# EAGLE design ArduFrauenfelderCNC_0.1-b9 (EAGLE 6.1)
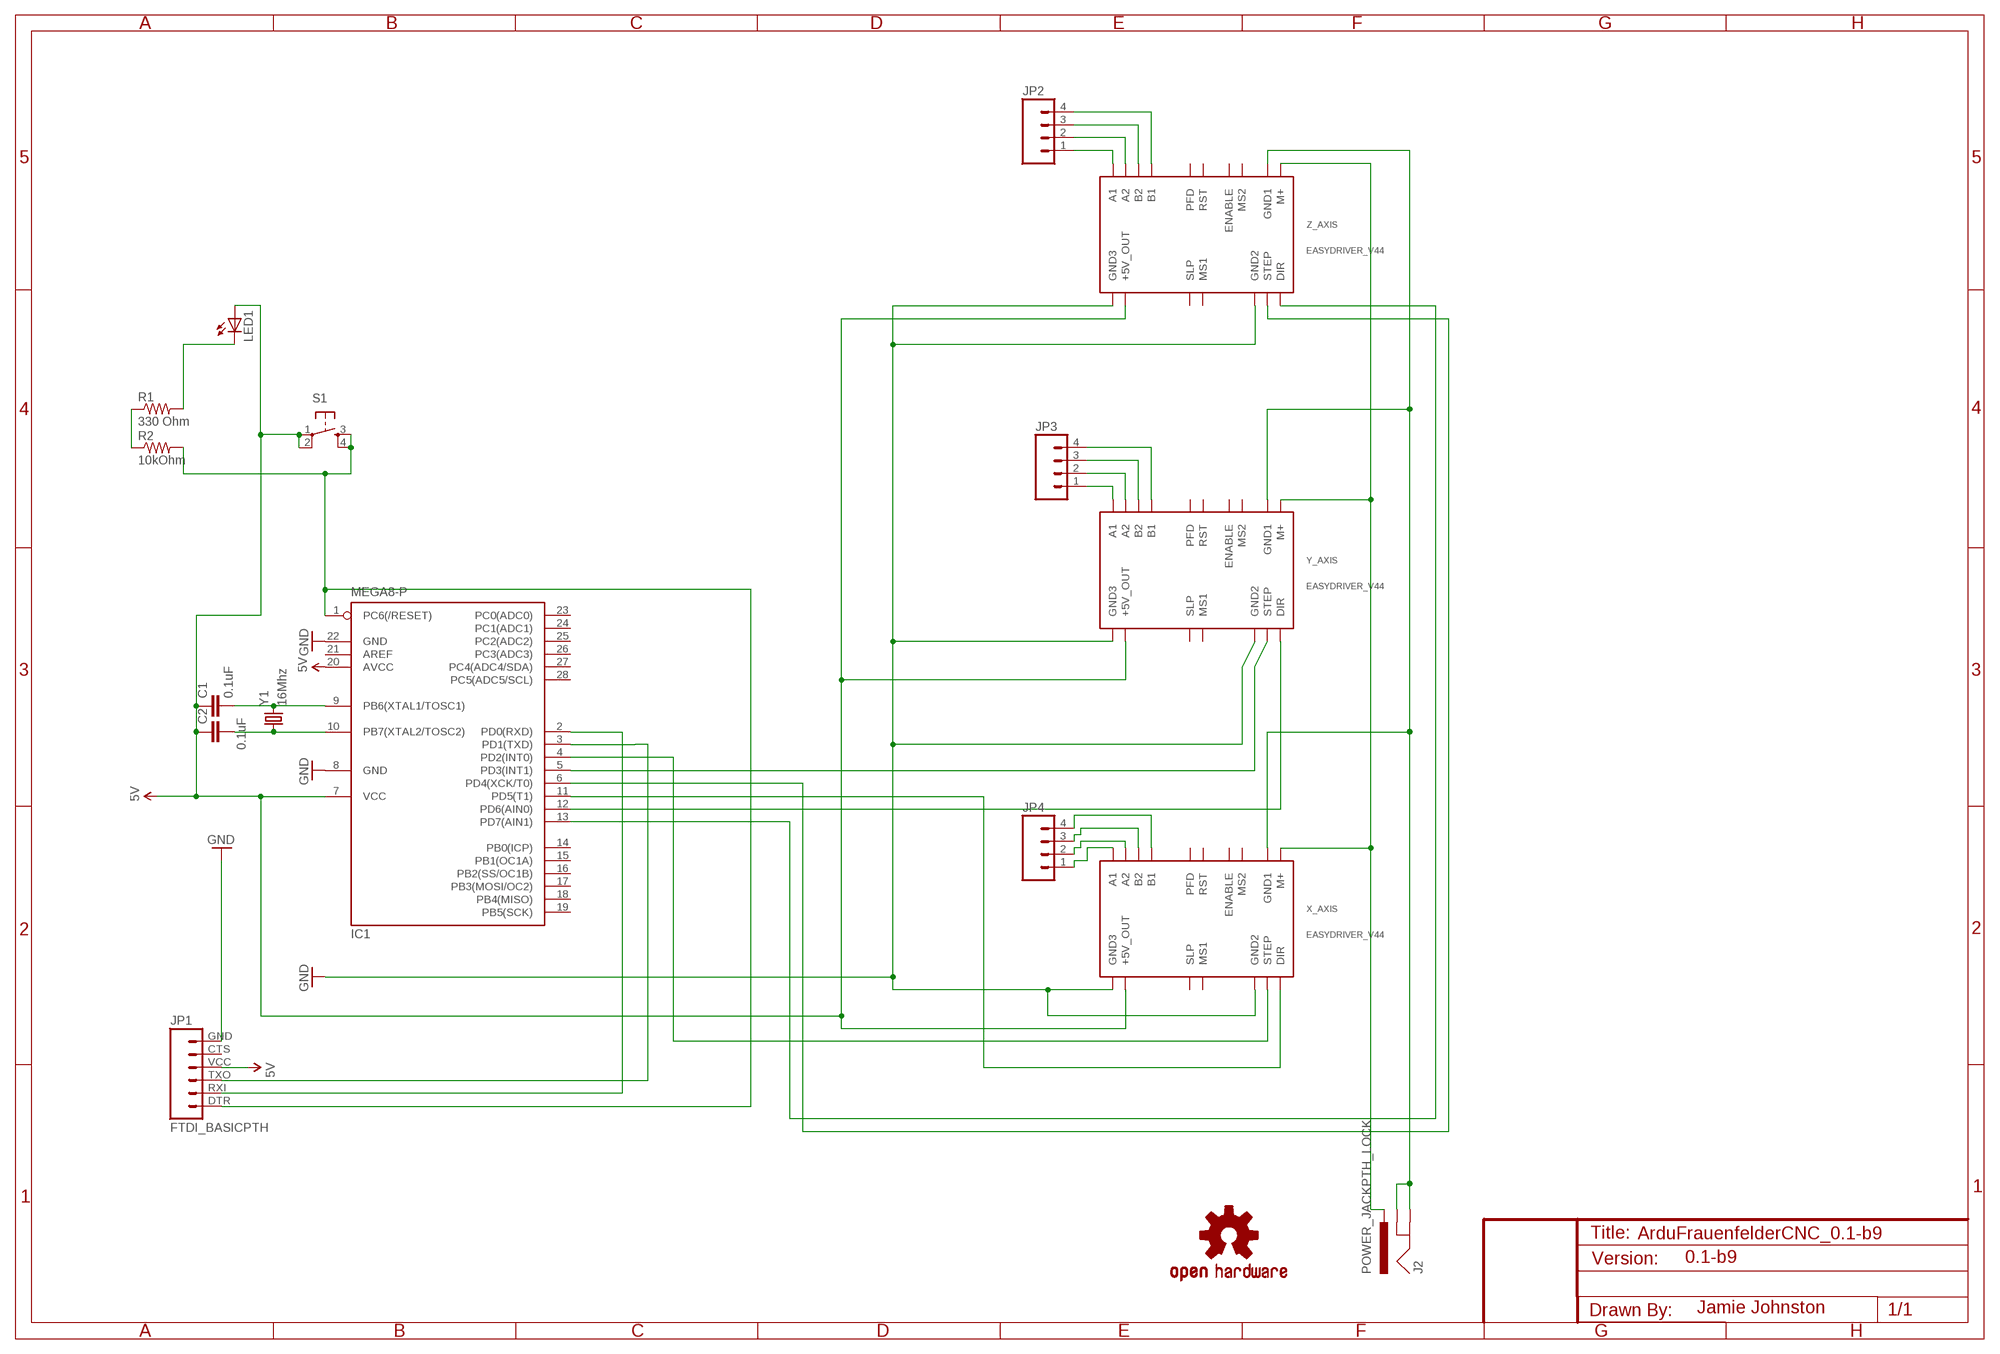
[diagram p0: schematic, sheet 1]

## Parts
C1  0.1uF  CAPPTH  [CAP-PTH-SMALL]
C2  0.1uF  CAPPTH  [CAP-PTH-SMALL]
IC1  MEGA8-P  [DIL28-3]
J2  POWER_JACKPTH_LOCK  [POWER_JACK_PTH_LOCK]
JP1  FTDI_BASICPTH  [FTDI_BASIC]
JP2  M04LOCK  [1X04_LOCK]
JP3  M04LOCK  [1X04_LOCK]
JP4  M04LOCK  [1X04_LOCK]
LED1  LED5MM  [LED5MM]
R1  330 Ohm  RESISTORPTH-1/4W  [AXIAL-0.4]
R2  10kOhm  RESISTORPTH-1/4W  [AXIAL-0.4]
S1  TAC_SWITCHPTH  [TACTILE-PTH]
U$2  OSHW-LOGOL  [OSHW-LOGO-L]
X_AXIS  EASYDRIVER_V44  [EASYDRIVER_V44]
Y1  16Mhz  CRYSTALHC49US  [HC49US]
Y_AXIS  EASYDRIVER_V44  [EASYDRIVER_V44]
Z_AXIS  EASYDRIVER_V44  [EASYDRIVER_V44]

## Nets
5V: C1.1 C2.1 IC1.7(VCC) IC1.20(AVCC) JP1.VCC LED1.A S1.1 S1.2 X_AXIS.P$11(+5V_OUT) Y_AXIS.P$11(+5V_OUT) Z_AXIS.P$11(+5V_OUT)
GND: IC1.8(GND) IC1.22(GND) JP1.GND X_AXIS.GND2 X_AXIS.GND3 Y_AXIS.GND2 Y_AXIS.GND3 Z_AXIS.GND2 Z_AXIS.GND3
N$1: C1.2 IC1.9(PB6(XTAL1/TOSC1)) Y1.2
N$2: C2.2 IC1.10(PB7(XTAL2/TOSC2)) Y1.1
N$3: IC1.5(PD3(INT1)) Y_AXIS.STEP
N$4: LED1.K(C) R1.P$2
N$5: IC1.1(PC6(/RESET)) JP1.DTR R2.P$2 S1.3 S1.4
N$6: R1.P$1 R2.P$1
N$7: JP2.1 Z_AXIS.A1
N$8: J2.PWR X_AXIS.M+ Y_AXIS.M+ Z_AXIS.M+
N$9: JP2.2 Z_AXIS.A2
N$10: J2.GND J2.GNDBREAK X_AXIS.GND1 Y_AXIS.GND1 Z_AXIS.GND1
N$11: IC1.3(PD1(TXD)) JP1.TXO
N$12: IC1.2(PD0(RXD)) JP1.RXI
N$13: IC1.12(PD6(AIN0)) Y_AXIS.DIR
N$14: IC1.4(PD2(INT0)) X_AXIS.STEP
N$15: JP2.3 Z_AXIS.B2
N$16: IC1.11(PD5(T1)) X_AXIS.DIR
N$17: JP2.4 Z_AXIS.B1
N$18: JP3.1 Y_AXIS.A1
N$19: IC1.13(PD7(AIN1)) Z_AXIS.DIR
N$20: IC1.6(PD4(XCK/T0)) Z_AXIS.STEP
N$21: JP3.2 Y_AXIS.A2
N$22: JP3.3 Y_AXIS.B2
N$23: JP3.4 Y_AXIS.B1
N$24: JP4.1 X_AXIS.A1
N$25: JP4.2 X_AXIS.A2
N$26: JP4.3 X_AXIS.B2
N$27: JP4.4 X_AXIS.B1
Unconnected: IC1.14(PB0(ICP)) IC1.15(PB1(OC1A)) IC1.16(PB2(SS/OC1B)) IC1.17(PB3(MOSI/OC2)) IC1.18(PB4(MISO)) IC1.19(PB5(SCK)) IC1.21(AREF) IC1.23(PC0(ADC0)) IC1.24(PC1(ADC1)) IC1.25(PC2(ADC2)) IC1.26(PC3(ADC3)) IC1.27(PC4(ADC4/SDA)) IC1.28(PC5(ADC5/SCL)) JP1.CTS X_AXIS.ENABLE X_AXIS.MS1 X_AXIS.MS2 X_AXIS.PFD X_AXIS.RST X_AXIS.SLEEP(SLP) Y_AXIS.ENABLE Y_AXIS.MS1 Y_AXIS.MS2 Y_AXIS.PFD Y_AXIS.RST Y_AXIS.SLEEP(SLP) Z_AXIS.ENABLE Z_AXIS.MS1 Z_AXIS.MS2 Z_AXIS.PFD Z_AXIS.RST Z_AXIS.SLEEP(SLP)

## Notes on the sheet
- 0.1-b9
- Jamie Johnston

## Library data of the parts
C1 C2 = SparkFun:CAP: Capacitor Standard 0603 ceramic capacitor, and 0.1" leaded capacitor.
IC1 = atmel:MEGA8-P: MICROCONTROLLER 8 Kbytes FLASH, 1 kbytes SRAM, 512 bytes EEPROM, USART, 4-channel 10 bit ADC, 2-channel 8 bit ADC Pin compatible with Atmega48, ATMega88, ATMega168 Source: avr.lbr; OC_FARNELL: unknown; OC_NEWARK: unknown
J2 = SparkFun:POWER_JACK: Power Jack This is the standard 5.5mm barrel jack for power. The PTH is the most common, proven, reliable, footprint. All others are experimental. The Slot footprint only works if the mill layer is transmitted to the PCB fab house so be warned. Spark Fun Electronics SKU : PRT-00119. Mating wall wart : TOL-00298 (and others)
JP1 = SparkFun:FTDI_BASIC: FTDI Basic: 3.3V and 5V
JP2-JP4 = SparkFun:M04: Header 4 Standard 4-pin 0.1" header. Use with straight break away headers (SKU : PRT-00116), right angle break away headers (PRT-00553), swiss pins (PRT-00743), machine pins (PRT-00117), and female headers (PRT-00115). Molex polarized connector foot print use with SKU : PRT-08231 with associated crimp pins and housings. 1MM SMD Version SKU: PRT-10208
LED1 = SparkFun:LED: LEDs Standard schematic elements and footprints for 5mm, 3mm, 1206, and 0603 sized LEDs. 5mm - Spark Fun Electronics SKU : COM-00529 (and others)
R1 R2 = SparkFun:RESISTOR: Resistor Basic schematic elements and footprints for 0603, 1206, and PTH resistors.
S1 = SparkFun:TAC_SWITCH: Momentary Switch Button commonly used for reset or general input. Spark Fun Electronics SKU : COM-00097
U$2 = SparkFun:OSHW-LOGO: Open Source Hardware Logo This logo indicates the piece of hardware it is found on incorporates a OSHW license and/or adheres to the definition of open source hardware found here: http://freedomdefined.org/OSHW
X_AXIS Y_AXIS Z_AXIS = EasyDriver:EASYDRIVER_V44: EasyDriver version 4.4 - http://www.schmalzhaus.com/EasyDriver
Y1 = SparkFun:CRYSTAL: Crystals Various standard crystals. Proven footprints. Spark Fun Electronics SKU : COM-00534

## Board
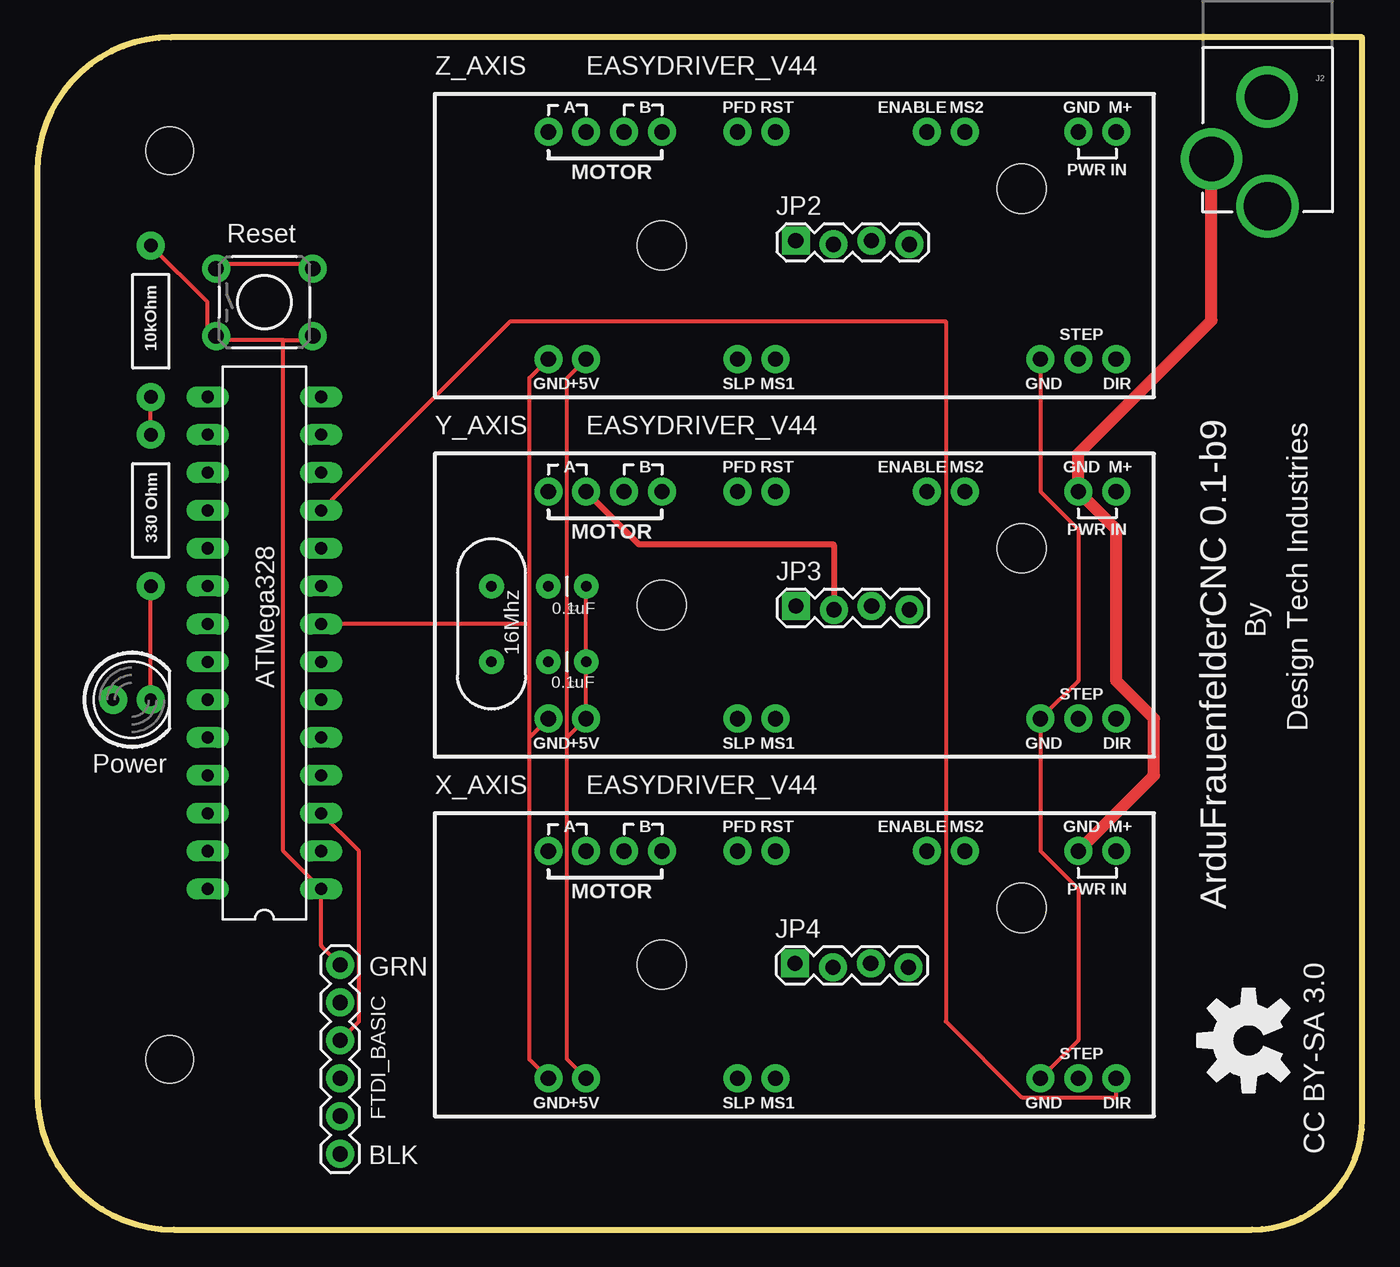
[diagram p1: board, top side]
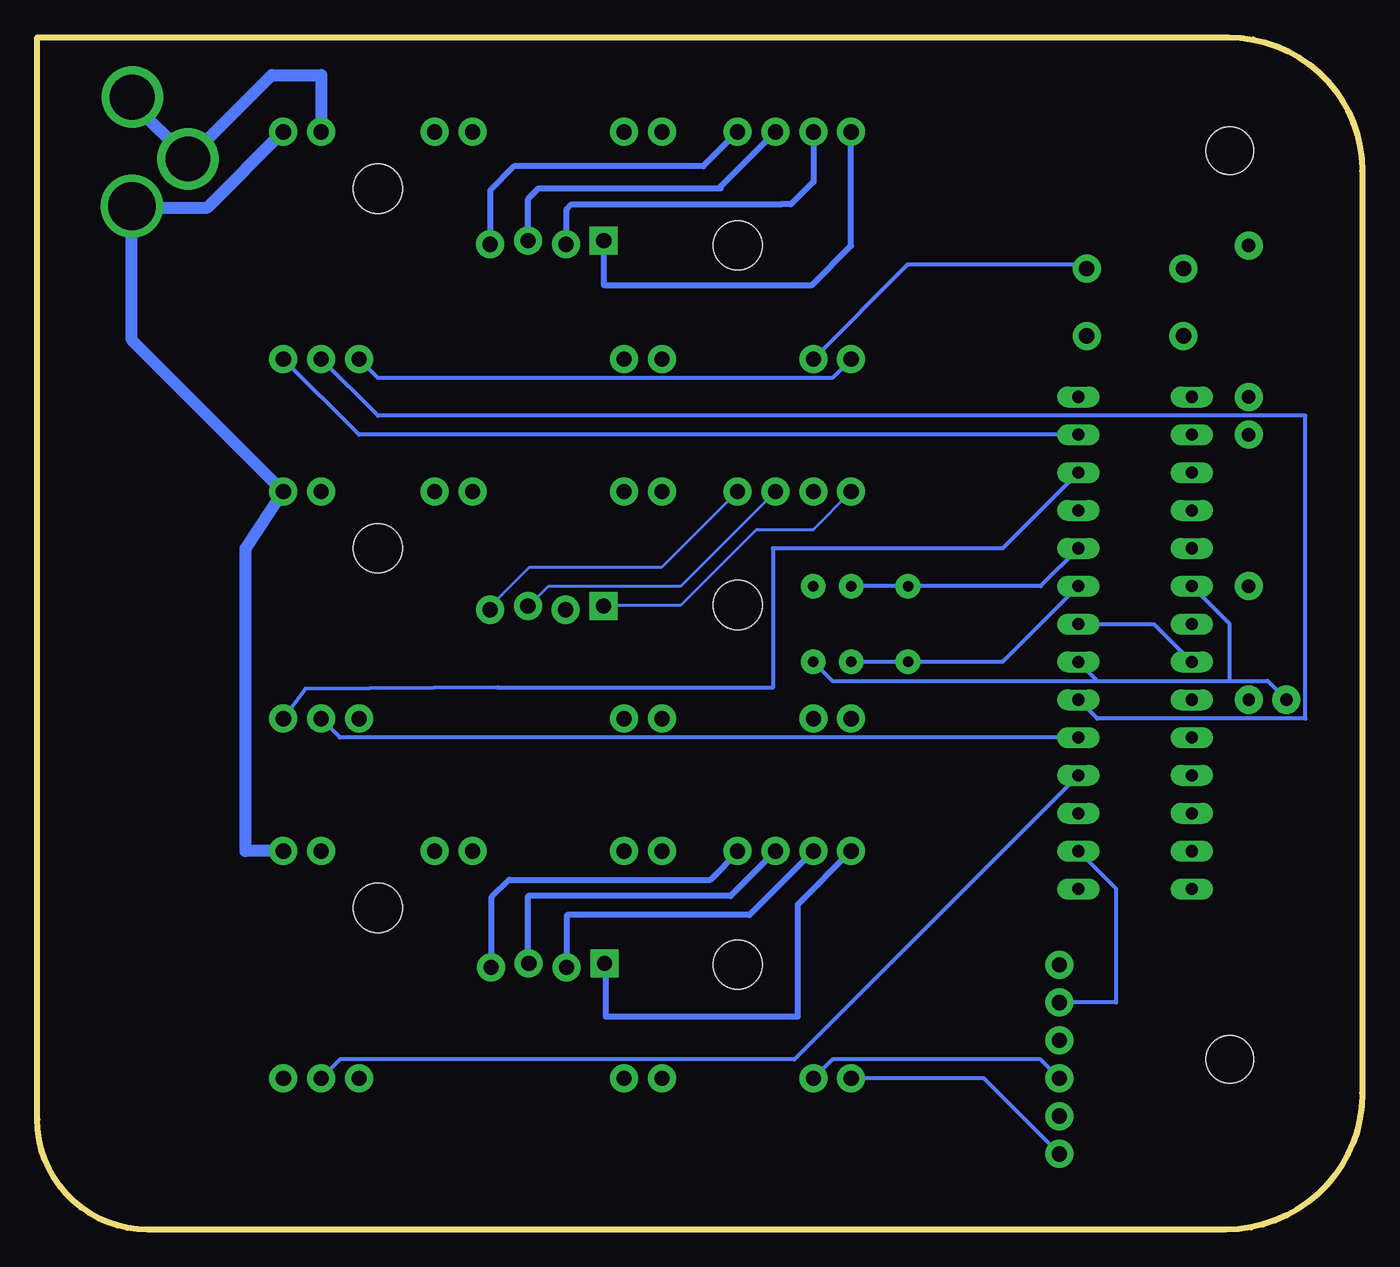
[diagram p2: board, bottom side, seen from below]

Size 88.9 x 80.01 mm. Coordinates in mm from the lower left corner, seen from the top.
Outline: 8.98,80.01 arc90 0,71.03 0,9.16 arc90 9.16,0 81.5,0 arc90 88.9,7.41 88.9,80.01 8.98,80.01
Copper layers (1*16): Top 0.035mm / dielectric 1.5mm / Bottom 0.035mm
Design rules: minimum track width 8mil, minimum drill 20mil, track to track 8mil, track to pad 8mil, pad to pad 8mil, via to via 8mil, smd to smd 8mil, copper to edge 10mil, drill to drill 8mil, minimum pad ring 12mil, minimum via ring 10mil, stop-mask expansion 4mil, vias tented up to drill 25mil, thermal gap 10mil
Holes 3.2 mm at 8.89,11.43 8.89,72.39

### Footprints (pad centres in the part's own frame; a part is rotated, then mirrored left to right if it is on the bottom)
CAP-PTH-SMALL = drill 0.7 pad 1.651: 1 0,0; 2 2.54,0
DIL28-3 = drill 0.813 long: 1 -16.51,-3.81; 2 -13.97,-3.81; 3 -11.43,-3.81; 4 -8.89,-3.81; 5 -6.35,-3.81; 6 -3.81,-3.81; 7 -1.27,-3.81; 8 1.27,-3.81; 9 3.81,-3.81; 10 6.35,-3.81; 11 8.89,-3.81; 12 11.43,-3.81; 13 13.97,-3.81; 14 16.51,-3.81; 15 16.51,3.81; 16 13.97,3.81; 17 11.43,3.81; 18 8.89,3.81; 19 6.35,3.81; 20 3.81,3.81; 21 1.27,3.81; 22 -1.27,3.81; 23 -3.81,3.81; 24 -6.35,3.81; 25 -8.89,3.81; 26 -11.43,3.81; 27 -13.97,3.81; 28 -16.51,3.81
POWER_JACK_PTH_LOCK = drill 2.997 pad 4.115: GND 0.025,6.557; GNDBREAK 3.762,10.7 | drill 3.2 pad 4.115: PWR 0,13.878
FTDI_BASIC = drill 1.016 pad 1.88: CTS 10.16,0; DTR 0,0; GND 12.7,0; RXI 2.54,0; TXO 5.08,0; VCC 7.62,0
1X04_LOCK = drill 1.016 pad 1.88 square: 1 0,0.127 | drill 1.016 pad 1.88: 2 2.54,-0.127; 3 5.08,0.127; 4 7.62,-0.127
LED5MM = drill 0.813 pad 1.88: A -1.27,0; K 1.27,0
AXIAL-0.4 = drill 0.9 pad 1.88: P$1 -5.08,0; P$2 5.08,0
TACTILE-PTH = drill 1.016 pad 1.88: 1 -3.251,2.261; 2 3.251,2.261; 3 -3.251,-2.261; 4 3.251,-2.261
EASYDRIVER_V44 = drill 1.016 pad 1.88: A1 -16.51,7.62; A2 -13.97,7.62; B1 -8.89,7.62; B2 -11.43,7.62; DIR 21.59,-7.62; ENABLE 8.89,7.62; GND1 19.05,7.62; GND2 16.51,-7.62; GND3 -16.51,-7.62; M+ 21.59,7.62; MS1 -1.27,-7.62; MS2 11.43,7.62; P$11 -13.97,-7.62; PFD -3.81,7.62; RST -1.27,7.62; SLEEP -3.81,-7.62; STEP 19.05,-7.62 | hole 3.302: 15.24,3.81; -8.89,0
HC49US = drill 0.7 pad 1.651: 1 -2.54,0; 2 2.54,0

### Placement (x,y rotation side)
C1  36.83,38.1 180 top
C2  36.83,43.18 180 top
IC1  15.24,39.37 90 top
J2  82.55,82.55 180 top
JP1  20.32,17.78 270 top
JP2  50.89,66.24 0 top
JP3  50.9,41.72 0 top
JP4  50.84,17.73 0 top
LED1  6.35,35.56 0 top
R1  7.62,48.26 270 top
R2  7.62,60.96 90 top
S1  15.24,62.23 0 top
U$2  81.28,12.7 90 top
X_AXIS  50.8,17.78 0 top
Y1  30.48,40.64 270 top
Y_AXIS  50.8,41.91 0 top
Z_AXIS  50.8,66.04 0 top

### Tracks (layer width: path | path; a pad name or v marks a point on that pad's centre or on a via)
5V
  Top 0.254: S1.1 12.7,64.77 17.78,64.77 S1.2 | C2.1 C1.1 Y_AXIS.P$11 35.56,33.02 | X_AXIS.P$11 35.56,11.43 35.56,33.02 | Z_AXIS.P$11 35.56,57.15 35.56,33.02
  Bottom 0.254: Z_AXIS.P$11 30.48,64.77 19.05,64.77 S1.2 | X_AXIS.P$11 35.56,11.43 21.59,11.43 JP1.VCC | 17.78,36.83 IC1.7 | 8.89,36.83 6.35,36.83 LED1.A | 17.78,36.83 8.89,36.83 | IC1.20 8.89,40.64 8.89,36.83 | C1.1 35.56,36.83 17.78,36.83
GND
  Top 0.254: X_AXIS.GND2 69.85,12.7 69.85,22.86 67.31,25.4 Y_AXIS.GND2 69.85,36.83 69.85,46.99 67.31,49.53 Z_AXIS.GND2 | X_AXIS.GND3 33.02,11.43 33.02,33.02 | 33.02,33.02 Y_AXIS.GND3 | Z_AXIS.GND3 33.02,57.15 33.02,40.64 | 33.02,33.02 33.02,40.64 | 33.02,40.64 IC1.8
  Bottom 0.254: IC1.22 13.97,40.64 IC1.8 | Z_AXIS.GND2 66.04,57.15 35.56,57.15 Z_AXIS.GND3 | JP1.GND 25.4,10.16 X_AXIS.GND3
N$1
  Bottom 0.254: IC1.9 24.13,38.1 Y1.2 C1.2
N$2
  Bottom 0.254: IC1.10 21.59,43.18 Y1.1 C2.2
N$3
  Bottom 0.254: IC1.5 68.58,33.02 Y_AXIS.STEP
N$4
  Top 0.254: LED1.K R1.P$2
N$5
  Top 0.254: 16.51,59.69 17.78,59.69 S1.4 | 16.51,59.69 12.7,59.69 S1.3 11.43,59.69 11.43,62.23 R2.P$2 | 16.51,59.69 16.51,25.4 IC1.1 19.05,19.05 JP1.DTR
N$6
  Top 0.254: R1.P$1 R2.P$1
N$7
  Bottom 0.406: JP2.1 50.89,63.39 36.92,63.39 34.29,66.03 Z_AXIS.A1
N$8
  Bottom 0.254: 82.55,68.58 J2.PWR
  Bottom 0.813: 82.55,68.58 82.55,59.69 Y_AXIS.M+ 74.93,45.72 74.93,25.4 X_AXIS.M+ | Z_AXIS.M+ 77.47,68.58 82.46,68.58 J2.PWR
N$9
  Bottom 0.406: JP2.2 53.38,66.16 53.38,68.49 53.07,68.8 39.5,68.8 38.99,68.8 38.33,68.8 36.82,70.32 36.82,73.65 Z_AXIS.A2
N$10
  Top 0.813: J2.GNDBREAK 78.79,61.01 69.85,52.07 Y_AXIS.GND1 72.39,46.99 72.39,36.83 74.93,34.29 74.93,30.48 X_AXIS.GND1
  Bottom 0.813: Z_AXIS.GND1 69.85,77.47 73.17,77.47 J2.GNDBREAK 82.53,75.59 J2.GND
N$11
  Top 0.254: IC1.3 21.59,25.4 21.59,13.97 JP1.TXO
N$12
  Bottom 0.254: IC1.2 16.51,22.86 16.51,15.24 JP1.RXI
N$13
  Bottom 0.254: IC1.12 24.13,45.72 39.54,45.72 39.54,36.36 58,36.36 58,36.4 70.91,36.28 Y_AXIS.DIR
N$14
  Bottom 0.254: IC1.4 38.1,11.43 68.58,11.43 X_AXIS.STEP
N$15
  Bottom 0.406: JP2.3 55.96,69.18 55.28,69.87 43.05,69.87 43.05,69.98 Z_AXIS.B2
N$16
  Top 0.254: IC1.11 31.75,60.96 60.96,60.96 60.96,13.97 66.04,8.89 72.39,8.89 X_AXIS.DIR
N$17
  Bottom 0.406: Z_AXIS.B1 44.22,71.35 56.89,71.35 58.51,69.73 JP2.4
N$18
  Bottom 0.203: Y_AXIS.A1 36.83,46.99 40.64,46.99 45.72,41.91 50.8,41.91 JP3.1
N$19
  Bottom 0.254: IC1.13 67.31,53.34 Z_AXIS.DIR
N$20
  Bottom 0.254: IC1.6 17.78,34.29 3.81,34.29 3.81,54.61 66.04,54.61 Z_AXIS.STEP
N$21
  Top 0.406: Y_AXIS.A2 40.35,46.01 53.38,46.01 53.44,45.94 JP3.2
N$22
  Bottom 0.203: Y_AXIS.B2 45.72,43.18 54.61,43.18 55.88,41.91 JP3.3
N$23
  Bottom 0.203: Y_AXIS.B1 46.99,44.45 55.88,44.45 58.42,41.91 JP3.4
N$24
  Bottom 0.406: X_AXIS.A1 37.88,21.8 37.88,14.29 50.77,14.29 50.77,17.78 JP4.1
N$25
  Bottom 0.406: X_AXIS.A2 41.12,21.11 53.35,21.11 53.35,17.64 JP4.2
N$26
  Bottom 0.406: X_AXIS.B2 42.39,22.38 55.96,22.38 55.96,17.9 JP4.3
N$27
  Bottom 0.406: JP4.4 58.41,17.66 58.41,22.31 57.24,23.48 43.74,23.48 41.91,25.31 X_AXIS.B1

### Text on the board
tPlace: Z_AXIS | EASYDRIVER_V44 | Reset | Design Tech Industries | Y_AXIS | EASYDRIVER_V44 | 0.1uF | By | 16Mhz | 0.1uF | ATMega328 | Power | X_AXIS | EASYDRIVER_V44 | ArduFrauenfelderCNC 0.1-b9 | GRN | FTDI_BASIC | CC BY-SA 3.0 | BLK